# Altium schematic sheet RF.SchDoc
size A4
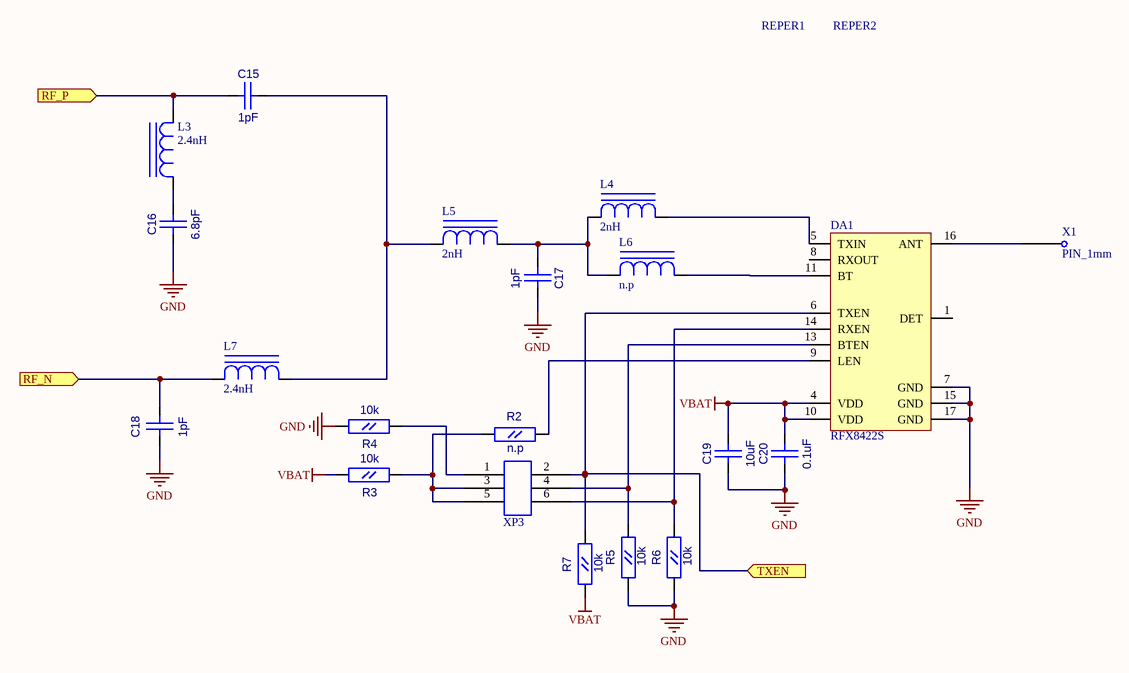
[diagram p0: RF.SchDoc]

## Parts
C15  1pF  [CC0603]
C16  6.8pF  [CC0603]
C17  1pF  [CC0603]
C18  1pF  [CC0603]
C19  10uF  [CC0805]
C20  0.1uF  [CC0603]
DA1  RFX8422S  [QFN-16_Skyworks]
L3  2.4nH  [L0402]
L4  2nH  [L0402]
L5  2nH  [L0402]
L6  n.p  [L0402]
L7  2.4nH  [L0402]
R2  n.p  [RC0603]
R3  10k  [RC0603]
R4  10k  [RC0603]
R5  10k  [RC0603]
R6  10k  [RC0603]
R7  10k  [RC0603]
REPER1  REPER1.2  [REPER1.2]  (value not drawn)
REPER2  REPER1.2  [REPER1.2]  (value not drawn)
X1  PIN_1mm  [PIN_1mm]
XP3  PLD06_SMD  [PLD06_SMD]  (value not drawn)

## Ports
RF_N (in), RF_P (in), TXEN (in)

## Nets
GND: C16.1(A) C17.2(B) C18.2(B) C19.1(A) C20.1(A) DA1.7(GND) DA1.15(GND) DA1.17(GND) R4.2(B) R5.1(A) R6.1(A)
VBAT: C19.2(B) C20.2(B) DA1.4(VDD) DA1.10(VDD) R3.2(B) R7.1(A)
RF_N: C18.1(A) L7.1(A) ; port RF_N
RF_P: C15.2(B) L3.2(C) ; port RF_P
TXEN: DA1.6(TXEN) R7.2(B) XP3.2 ; port TXEN
NetC15_1: C15.1(A) L5.1(A) L7.2(C)
NetC16_2: C16.2(B) L3.1(A)
NetC17_1: C17.1(A) L4.1(A) L5.2(C) L6.1(A)
NetDA1_5: DA1.5(TXIN) L4.2(C)
NetDA1_9: DA1.9(LEN) R2.2(B)
NetDA1_11: DA1.11(BT) L6.2(C)
NetDA1_13: DA1.13(BTEN) R5.2(B) XP3.4
NetDA1_14: DA1.14(RXEN) R6.2(B) XP3.6
NetDA1_16: DA1.16(ANT) X1.1
NetR2_1: R2.1(A) R3.1(A) XP3.3 XP3.5
NetR4_1: R4.1(A) XP3.1

Not connected (* = marked no-connect by the designer): DA1 1(DET) 8(RXOUT); REPER1 1; REPER2 1

## Library data of the parts
C15-C18 C20 = CC0603
  C15 C17 C18: Value: 1pF
  C16: Value: 6.8pF
  C20: Value: 0.1uF
C19 = CC0805: Value: 10uF
L3-L7 = L0402
  L3 L7: Value: 2.4nH
  L4 L5: Value: 2nH
  L6: Value: n.p
R2-R7 = RC0603
  R2: Value: n.p
  R3-R7: Value: 10k
DA1 = RFX8422S: Value: RFX8422S
REPER1 REPER2 = REPER1.2: Value: *
XP3 = PLD06_SMD: Value: PLD06_SMD